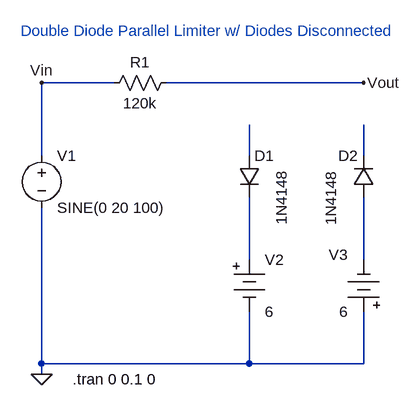
[diagram p0: schematic 2EEB_VELASCO_EXPT4_CKT3.asc]
2EEB_VELASCO_EXPT4_CKT3.asc, the LTspice schematic file:
Version 4
SHEET 1 880 680
WIRE 208 -16 96 -16
WIRE 592 -16 288 -16
WIRE 96 96 96 -16
WIRE 416 96 416 48
WIRE 592 96 592 48
WIRE 416 256 416 160
WIRE 592 256 592 160
WIRE 96 416 96 176
WIRE 416 416 416 336
WIRE 416 416 96 416
WIRE 592 416 592 336
WIRE 592 416 416 416
WIRE 96 432 96 416
FLAG 96 432 0
FLAG 592 -16 Vout
FLAG 96 -16 Vin
SYMBOL voltage 96 80 R0
SYMATTR InstName V1
SYMATTR Value SINE(0 20 100)
SYMBOL res 304 -32 R90
WINDOW 0 0 56 VBottom 2
WINDOW 3 32 56 VTop 2
SYMATTR InstName R1
SYMATTR Value 120k
SYMBOL diode 400 96 R0
WINDOW 3 66 106 VLeft 2
SYMATTR InstName D1
SYMATTR Value 1N4148
SYMBOL Misc\\battery 416 240 R0
SYMATTR InstName V2
SYMATTR Value 6
SYMBOL diode 608 160 R180
WINDOW 0 24 64 Left 2
WINDOW 3 66 42 VLeft 2
SYMATTR InstName D2
SYMATTR Value 1N4148
SYMBOL Misc\\battery 592 352 R180
WINDOW 0 24 104 Left 2
WINDOW 3 24 16 Left 2
SYMATTR InstName V3
SYMATTR Value 6
TEXT 144 440 Left 2 !.tran 0 0.1 0
TEXT 64 -96 Left 2 ;Double Diode Parallel Limiter w/ Diodes Disconnected

The netlist it stands for:
* 2EEB_VELASCO_EXPT4_CKT3.asc
V1 Vin 0 SINE(0 20 100)
R1 Vout Vin 120k
D1 N001 N003 1N4148
V2 N003 0 6
D2 N004 N002 1N4148
V3 0 N004 6
.model D D
.lib standard.dio
.tran 0 0.1 0
* Double Diode Parallel Limiter w/ Diodes Disconnected
.backanno
.end